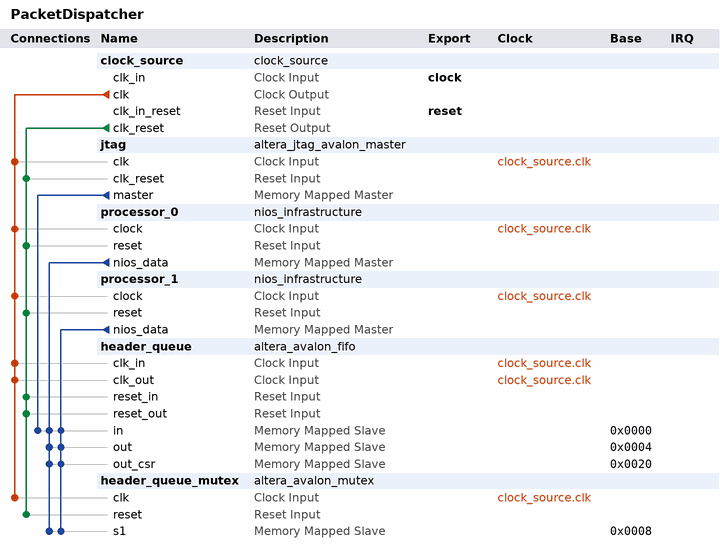
[diagram p0: system contents]
# Platform Designer (Qsys) system PacketDispatcher, Cyclone V 5CSEBA6U23I7
# Parameters at their usual value, and those the tool derives, are not listed.
package require -exact qsys 18.1
create_system PacketDispatcher
set_project_property DEVICE_FAMILY {Cyclone V}
set_project_property DEVICE 5CSEBA6U23I7

add_instance clock_source clock_source 18.1
set_instance_parameter_value clock_source clockFrequency 100000000

add_instance jtag altera_jtag_avalon_master 18.1

add_instance processor_0 nios_infrastructure 1.0

add_instance processor_1 nios_infrastructure 1.0

add_instance header_queue altera_avalon_fifo 18.1
set_instance_parameter_value header_queue bitsPerSymbol 16
set_instance_parameter_value header_queue channelWidth 8
set_instance_parameter_value header_queue errorWidth 8
set_instance_parameter_value header_queue fifoDepth 64
set_instance_parameter_value header_queue fifoInputInterfaceOptions AVALONMM_WRITE
set_instance_parameter_value header_queue fifoOutputInterfaceOptions AVALONMM_READ
set_instance_parameter_value header_queue singleClockMode false
set_instance_parameter_value header_queue symbolsPerBeat 2
set_instance_parameter_value header_queue useIRQ false
set_instance_parameter_value header_queue usePacket true
set_instance_parameter_value header_queue useReadControl true
set_instance_parameter_value header_queue useWriteControl false

add_instance header_queue_mutex altera_avalon_mutex 18.1

# connections
add_connection clock_source.clk header_queue.clk_in clock
add_connection clock_source.clk header_queue.clk_out clock
add_connection clock_source.clk header_queue_mutex.clk clock
add_connection clock_source.clk jtag.clk clock
add_connection clock_source.clk processor_0.clock clock
add_connection clock_source.clk processor_1.clock clock
add_connection clock_source.clk_reset header_queue.reset_in reset
add_connection clock_source.clk_reset header_queue.reset_out reset
add_connection clock_source.clk_reset header_queue_mutex.reset reset
add_connection clock_source.clk_reset jtag.clk_reset reset
add_connection clock_source.clk_reset processor_0.reset reset
add_connection clock_source.clk_reset processor_1.reset reset
add_connection jtag.master header_queue.in avalon
set_connection_parameter_value jtag.master/header_queue.in baseAddress 0x0000
add_connection processor_0.nios_data header_queue.in avalon
set_connection_parameter_value processor_0.nios_data/header_queue.in baseAddress 0x0000
add_connection processor_0.nios_data header_queue.out avalon
set_connection_parameter_value processor_0.nios_data/header_queue.out baseAddress 0x0004
add_connection processor_0.nios_data header_queue.out_csr avalon
set_connection_parameter_value processor_0.nios_data/header_queue.out_csr baseAddress 0x0020
add_connection processor_0.nios_data header_queue_mutex.s1 avalon
set_connection_parameter_value processor_0.nios_data/header_queue_mutex.s1 baseAddress 0x0008
add_connection processor_1.nios_data header_queue.in avalon
set_connection_parameter_value processor_1.nios_data/header_queue.in baseAddress 0x0000
add_connection processor_1.nios_data header_queue.out avalon
set_connection_parameter_value processor_1.nios_data/header_queue.out baseAddress 0x0004
add_connection processor_1.nios_data header_queue.out_csr avalon
set_connection_parameter_value processor_1.nios_data/header_queue.out_csr baseAddress 0x0020
add_connection processor_1.nios_data header_queue_mutex.s1 avalon
set_connection_parameter_value processor_1.nios_data/header_queue_mutex.s1 baseAddress 0x0008

# exported interfaces
add_interface clock clock sink
set_interface_property clock EXPORT_OF clock_source.clk_in
add_interface reset reset sink
set_interface_property reset EXPORT_OF clock_source.clk_in_reset

set_interconnect_requirement {$system} qsys_mm.clockCrossingAdapter HANDSHAKE
set_interconnect_requirement {$system} qsys_mm.enableEccProtection FALSE
set_interconnect_requirement {$system} qsys_mm.insertDefaultSlave FALSE
set_interconnect_requirement {$system} qsys_mm.maxAdditionalLatency 1

save_system PacketDispatcher.qsys
